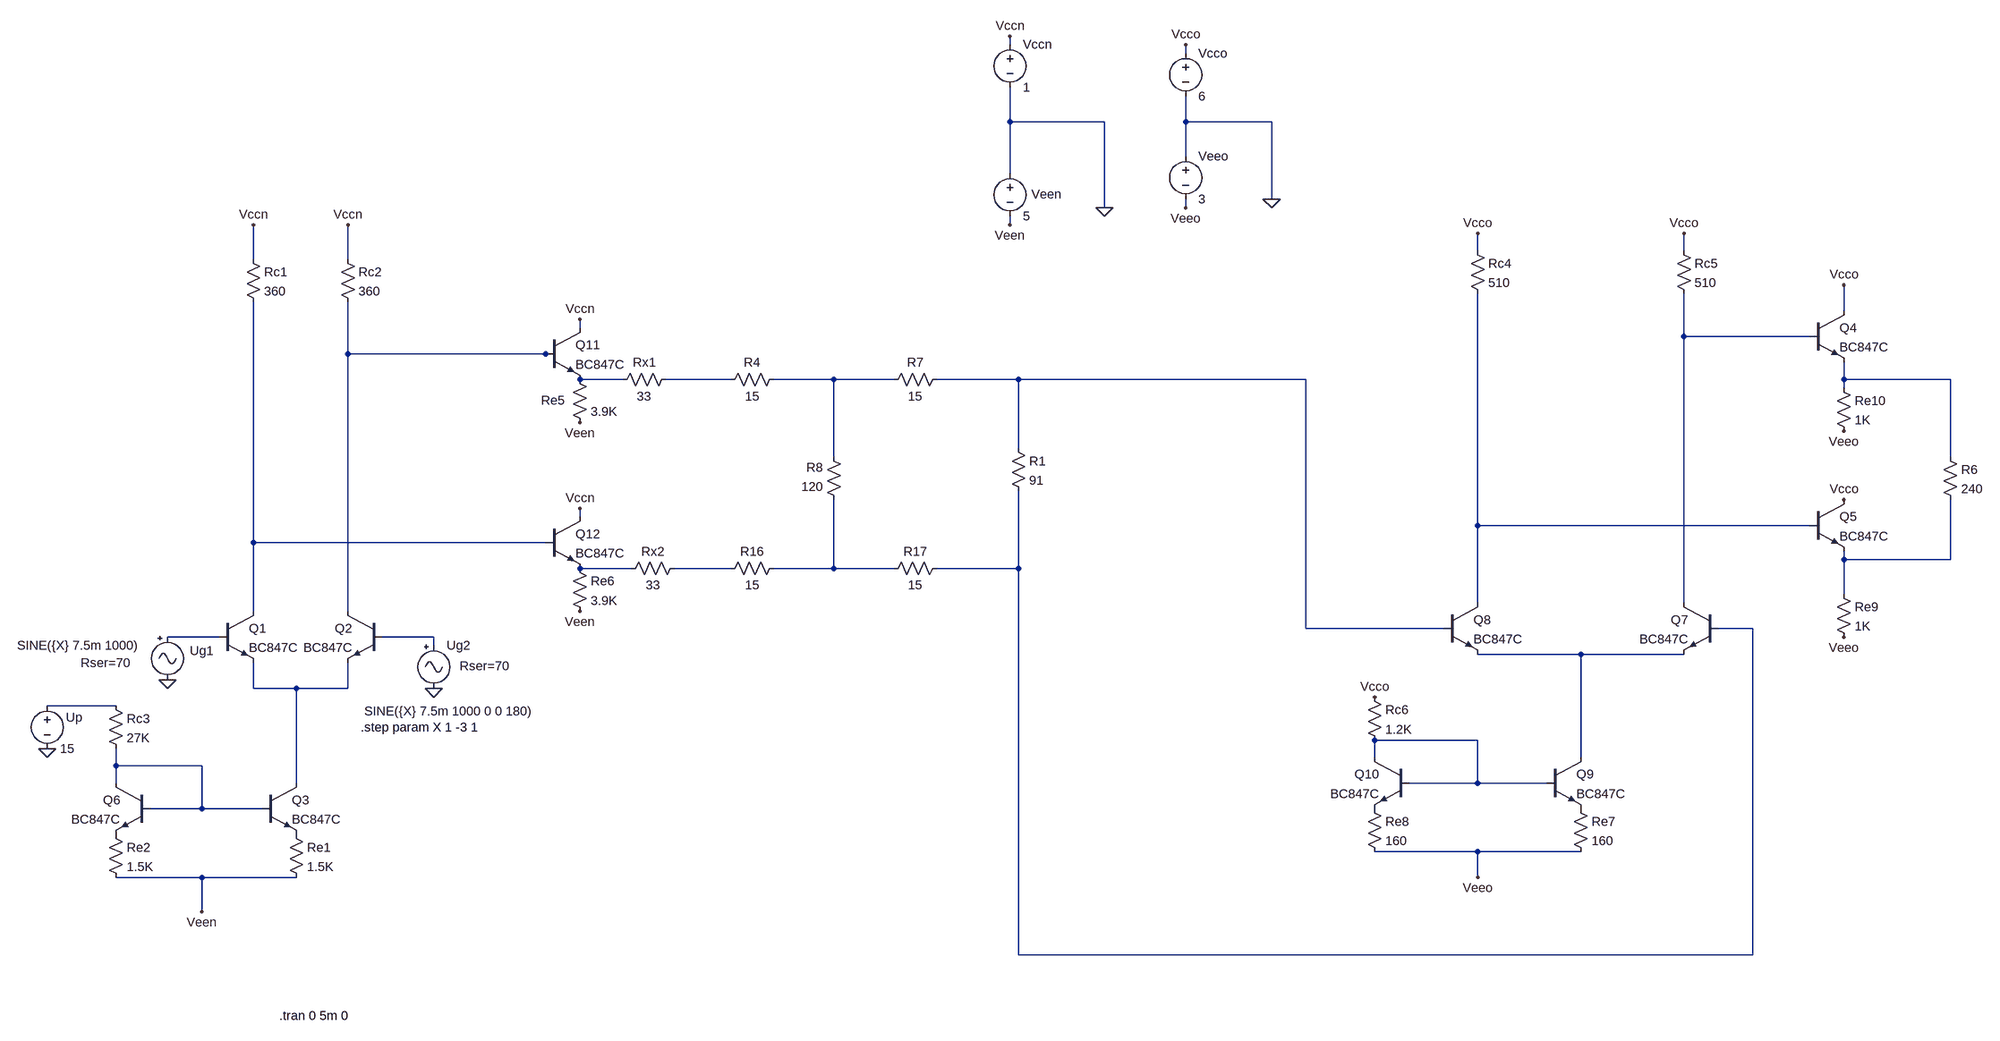
[diagram p0: schematic Linia_transmisyjna.asc]
Linia_transmisyjna.asc, the LTspice schematic file:
Version 4
SHEET 1 3444 936
WIRE 1152 -1056 1152 -1072
WIRE 1536 -1040 1536 -1056
WIRE 1152 -912 1152 -976
WIRE 1328 -912 1152 -912
WIRE 1536 -912 1536 -960
WIRE 1696 -912 1536 -912
WIRE 1536 -848 1536 -912
WIRE 1152 -816 1152 -912
WIRE 1696 -768 1696 -912
WIRE 1328 -752 1328 -912
WIRE 1536 -752 1536 -768
WIRE 1152 -720 1152 -736
WIRE 2080 -672 2080 -704
WIRE 2464 -672 2464 -704
WIRE -352 -656 -352 -720
WIRE -176 -656 -176 -720
WIRE 2912 -560 2912 -608
WIRE 256 -528 256 -544
WIRE 2464 -512 2464 -592
WIRE 2848 -512 2464 -512
WIRE -176 -480 -176 -576
WIRE 192 -480 -176 -480
WIRE 208 -480 192 -480
WIRE 336 -432 256 -432
WIRE 592 -432 416 -432
WIRE 784 -432 672 -432
WIRE 896 -432 784 -432
WIRE 1168 -432 976 -432
WIRE 1760 -432 1168 -432
WIRE 2912 -432 2912 -464
WIRE 3232 -432 2912 -432
WIRE 2912 -416 2912 -432
WIRE 1168 -304 1168 -432
WIRE 784 -288 784 -432
WIRE 3232 -288 3232 -432
WIRE 256 -176 256 -192
WIRE 2080 -160 2080 -592
WIRE 2848 -160 2080 -160
WIRE -352 -128 -352 -576
WIRE 192 -128 -352 -128
WIRE 2912 -96 2912 -112
WIRE 3232 -96 3232 -208
WIRE 3232 -96 2912 -96
WIRE 352 -80 256 -80
WIRE 592 -80 432 -80
WIRE 784 -80 784 -208
WIRE 784 -80 672 -80
WIRE 896 -80 784 -80
WIRE 1168 -80 1168 -224
WIRE 1168 -80 976 -80
WIRE 2912 -32 2912 -96
WIRE 2080 -16 2080 -160
WIRE 2464 -16 2464 -512
WIRE -352 0 -352 -128
WIRE -176 0 -176 -480
WIRE 1760 32 1760 -432
WIRE 2016 32 1760 32
WIRE 2592 32 2528 32
WIRE -416 48 -512 48
WIRE -16 48 -112 48
WIRE -16 64 -16 48
WIRE 2272 80 2080 80
WIRE 2464 80 2272 80
WIRE -352 144 -352 96
WIRE -272 144 -352 144
WIRE -176 144 -176 96
WIRE -176 144 -272 144
WIRE -608 176 -736 176
WIRE 2080 240 1888 240
WIRE 1888 272 1888 240
WIRE 2272 272 2272 80
WIRE -608 288 -608 256
WIRE -448 288 -608 288
WIRE -608 320 -608 288
WIRE -272 320 -272 144
WIRE 2080 320 2080 240
WIRE 2080 320 1952 320
WIRE 2208 320 2080 320
WIRE -448 368 -448 288
WIRE -448 368 -544 368
WIRE -336 368 -448 368
WIRE 2080 448 1888 448
WIRE 2272 448 2080 448
WIRE -448 496 -608 496
WIRE -272 496 -448 496
WIRE 2080 496 2080 448
WIRE -448 560 -448 496
WIRE 1168 640 1168 -80
WIRE 2592 640 2592 32
WIRE 2592 640 1168 640
FLAG -512 128 0
FLAG -16 144 0
FLAG 1696 -768 0
FLAG -736 256 0
FLAG 256 -544 Vccn
FLAG -176 -720 Vccn
FLAG -352 -720 Vccn
FLAG 256 -352 Veen
FLAG 256 0 Veen
FLAG 256 -192 Vccn
FLAG -448 560 Veen
FLAG 2080 -704 Vcco
FLAG 2464 -704 Vcco
FLAG 2080 496 Veeo
FLAG 2912 -608 Vcco
FLAG 2912 -208 Vcco
FLAG 2912 -336 Veeo
FLAG 2912 48 Veeo
FLAG 1888 160 Vcco
FLAG 1328 -752 0
FLAG 1152 -1072 Vccn
FLAG 1152 -720 Veen
FLAG 1536 -752 Veeo
FLAG 1536 -1056 Vcco
DATAFLAG 1168 -912 ""
DATAFLAG 1584 -912 ""
SYMBOL Misc\\signal -512 32 R0
WINDOW 3 -280 32 Left 2
WINDOW 123 0 0 Left 0
WINDOW 39 -162 64 Left 2
WINDOW 0 42 42 Left 2
SYMATTR Value SINE({X} 7.5m 1000)
SYMATTR SpiceLine Rser=70
SYMATTR InstName Ug1
SYMBOL npn -416 0 R0
SYMATTR InstName Q1
SYMATTR Value BC847C
SYMBOL npn -112 0 M0
SYMATTR InstName Q2
SYMATTR Value BC847C
SYMBOL res -368 -672 R0
SYMATTR InstName Rc1
SYMATTR Value 360
SYMBOL res -192 -672 R0
SYMATTR InstName Rc2
SYMATTR Value 360
SYMBOL voltage 1152 -1072 R0
WINDOW 123 0 0 Left 0
WINDOW 39 0 0 Left 0
SYMATTR InstName Vccn
SYMATTR Value 1
SYMBOL npn -336 320 R0
SYMATTR InstName Q3
SYMATTR Value BC847C
SYMBOL res -288 400 R0
SYMATTR InstName Re1
SYMATTR Value 1.5K
SYMBOL voltage 1152 -832 R0
WINDOW 123 0 0 Left 0
WINDOW 39 0 0 Left 0
WINDOW 0 40 55 Left 2
SYMATTR InstName Veen
SYMATTR Value 5
SYMBOL Misc\\signal -16 48 R0
WINDOW 123 0 0 Left 0
WINDOW 39 48 54 Left 2
WINDOW 3 -129 138 Left 2
SYMATTR SpiceLine Rser=70
SYMATTR Value SINE({X} 7.5m 1000 0 0 180)
SYMATTR InstName Ug2
SYMBOL res -624 400 R0
SYMATTR InstName Re2
SYMATTR Value 1.5K
SYMBOL res -624 160 R0
SYMATTR InstName Rc3
SYMATTR Value 27K
SYMBOL npn 2848 -560 R0
SYMATTR InstName Q4
SYMATTR Value BC847C
SYMBOL npn 2848 -208 R0
SYMATTR InstName Q5
SYMATTR Value BC847C
SYMBOL res 2896 -432 R0
SYMATTR InstName Re10
SYMATTR Value 1K
SYMBOL res 2896 -48 R0
SYMATTR InstName Re9
SYMATTR Value 1K
SYMBOL res 3216 -304 R0
SYMATTR InstName R6
SYMATTR Value 240
SYMBOL npn -544 320 M0
SYMATTR InstName Q6
SYMATTR Value BC847C
SYMBOL npn 2528 -16 M0
SYMATTR InstName Q7
SYMATTR Value BC847C
SYMBOL npn 2016 -16 R0
SYMATTR InstName Q8
SYMATTR Value BC847C
SYMBOL res 2064 -688 R0
SYMATTR InstName Rc4
SYMATTR Value 510
SYMBOL res 2448 -688 R0
SYMATTR InstName Rc5
SYMATTR Value 510
SYMBOL voltage 1536 -1056 R0
WINDOW 123 0 0 Left 0
WINDOW 39 0 0 Left 0
SYMATTR InstName Vcco
SYMATTR Value 6
SYMBOL npn 2208 272 R0
SYMATTR InstName Q9
SYMATTR Value BC847C
SYMBOL npn 1952 272 M0
SYMATTR InstName Q10
SYMATTR Value BC847C
SYMBOL res 1872 352 R0
SYMATTR InstName Re8
SYMATTR Value 160
SYMBOL res 2256 352 R0
SYMATTR InstName Re7
SYMATTR Value 160
SYMBOL voltage 1536 -864 R0
WINDOW 123 0 0 Left 0
WINDOW 39 0 0 Left 0
SYMATTR InstName Veeo
SYMATTR Value 3
SYMBOL res 1872 144 R0
SYMATTR InstName Rc6
SYMATTR Value 1.2K
SYMBOL res 688 -448 R90
WINDOW 0 0 56 VBottom 2
WINDOW 3 32 56 VTop 2
SYMATTR InstName R4
SYMATTR Value 15
SYMBOL res 992 -448 R90
WINDOW 0 0 56 VBottom 2
WINDOW 3 32 56 VTop 2
SYMATTR InstName R7
SYMATTR Value 15
SYMBOL res 800 -192 R180
WINDOW 0 36 76 Left 2
WINDOW 3 36 40 Left 2
SYMATTR InstName R8
SYMATTR Value 120
SYMBOL res 576 -64 R270
WINDOW 0 32 56 VTop 2
WINDOW 3 0 56 VBottom 2
SYMATTR InstName R16
SYMATTR Value 15
SYMBOL res 880 -64 R270
WINDOW 0 32 56 VTop 2
WINDOW 3 0 56 VBottom 2
SYMATTR InstName R17
SYMATTR Value 15
SYMBOL voltage -736 160 R0
WINDOW 123 0 0 Left 0
WINDOW 39 0 0 Left 0
WINDOW 0 35 38 Left 2
SYMATTR InstName Up
SYMATTR Value 15
SYMBOL npn 192 -528 R0
SYMATTR InstName Q11
SYMATTR Value BC847C
SYMBOL npn 192 -176 R0
SYMATTR InstName Q12
SYMATTR Value BC847C
SYMBOL res 240 -448 R0
WINDOW 0 -56 55 Left 2
SYMATTR InstName Re5
SYMATTR Value 3.9K
SYMBOL res 240 -96 R0
SYMATTR InstName Re6
SYMATTR Value 3.9K
SYMBOL res 432 -448 R90
WINDOW 0 0 56 VBottom 2
WINDOW 3 32 56 VTop 2
SYMATTR InstName Rx1
SYMATTR Value 33
SYMBOL res 448 -96 R90
WINDOW 0 0 56 VBottom 2
WINDOW 3 32 56 VTop 2
SYMATTR InstName Rx2
SYMATTR Value 33
SYMBOL res 1152 -320 R0
SYMATTR InstName R1
SYMATTR Value 91
TEXT -304 824 Left 2 !.tran 0 5m 0
TEXT -152 216 Left 2 !.step param X 1 -3 1

The netlist it stands for:
* Linia_transmisyjna.asc
V§Ug1 N015 0 SINE({X} 7.5m 1000) Rser=70
Q1 N009 N015 N018 0 BC847C
Q2 N002 N016 N018 0 BC847C
Rc1 Vccn N009 360
Rc2 Vccn N002 360
Vccn Vccn 0 1
Q3 N018 N021 P001 0 BC847C
Re1 P001 Veen 1.5K
Veen 0 Veen 5
V§Ug2 N016 0 SINE({X} 7.5m 1000 0 0 180) Rser=70
Re2 P002 Veen 1.5K
Rc3 N019 N021 27K
Q4 Vcco N001 N007 0 BC847C
Q5 Vcco N008 N010 0 BC847C
Re10 N007 Veeo 1K
Re9 N010 Veeo 1K
R6 N007 N010 240
Q6 N021 N021 P002 0 BC847C
Q7 N001 N014 N017 0 BC847C
Q8 N008 N006 N017 0 BC847C
Rc4 Vcco N008 510
Rc5 Vcco N001 510
Vcco Vcco 0 6
Q9 N017 N020 P003 0 BC847C
Q10 N020 N020 P004 0 BC847C
Re8 P004 Veeo 160
Re7 P003 Veeo 160
Veeo 0 Veeo 3
Rc6 Vcco N020 1.2K
R4 N005 N004 15
R7 N006 N005 15
R8 N013 N005 120
R16 N012 N013 15
R17 N013 N014 15
V§Up N019 0 15
Q11 Vccn N002 N003 0 BC847C
Q12 Vccn N009 N011 0 BC847C
Re5 N003 Veen 3.9K
Re6 N011 Veen 3.9K
Rx1 N004 N003 33
Rx2 N012 N011 33
R1 N006 N014 91
.model NPN NPN
.model PNP PNP
.lib standard.bjt
.tran 0 5m 0
.step param X 1 -3 1
.backanno
.end